# Altium schematic sheet converter.SchDoc
size A3; SheetNumber: 3; SheetTotal: 5
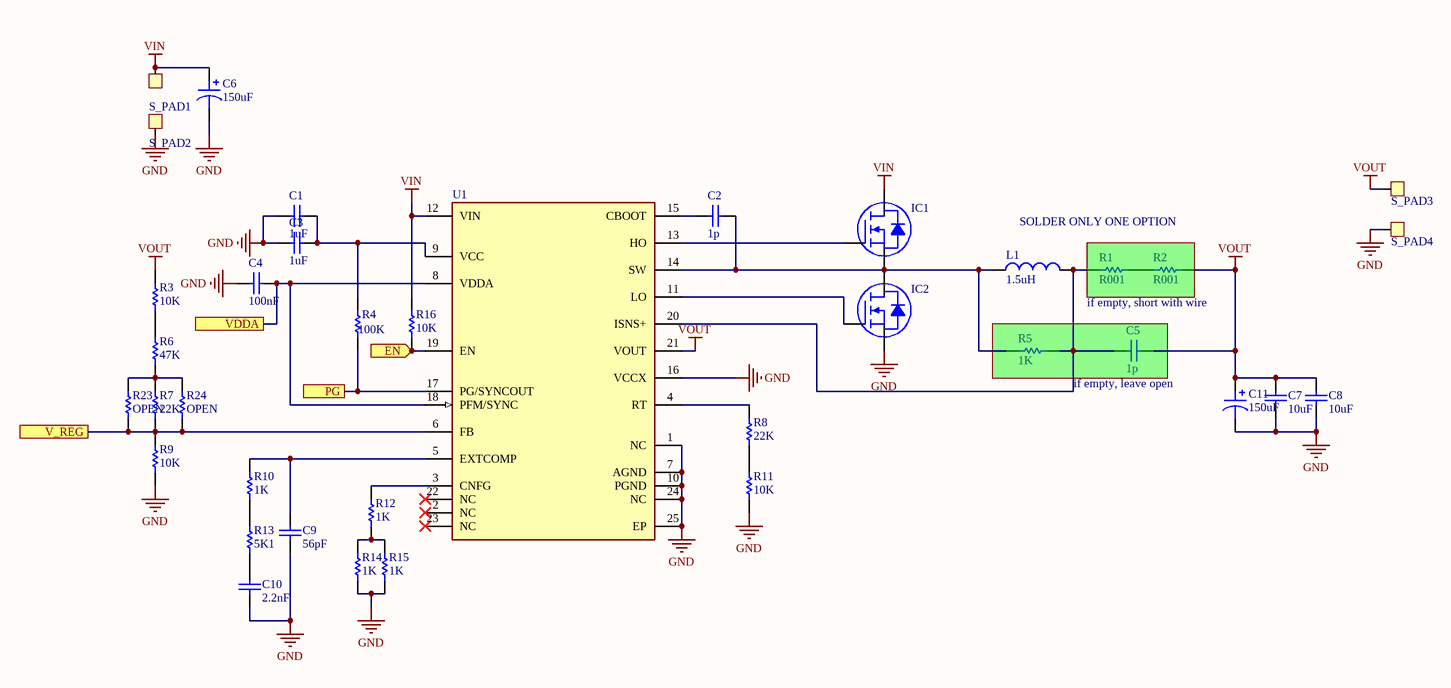
[diagram p0: converter.SchDoc]

## Parts
C1  value 1uF  [SMD-0603-RES]  (hidden comment: Capacitor)
C2  value 1p  [SMD-0603-RES]  (hidden comment: Capacitor)
C3  value 1uF  [SMD-0603-RES]  (hidden comment: Capacitor)
C4  value 100nF  [SMD-0603-RES]  (hidden comment: Capacitor)
C5  value 1p  [SMD-0603-RES]  (hidden comment: Capacitor)
C6  150uF  [CAPAE7266X80M]
C7  value 10uF  [SMD-0603-RES]  (hidden comment: Capacitor)
C8  value 10uF  [SMD-0603-RES]  (hidden comment: Capacitor)
C9  value 56pF  [SMD-0603-RES]  (hidden comment: Capacitor)
C10  value 2.2nF  [SMD-0603-RES]  (hidden comment: Capacitor)
C11  150uF  [CAPAE7266X80M]
IC1  MOSFET N-CH SOT-23-3  [DPAK228P1975X238-3N]  (value not drawn)
IC2  MOSFET N-CH SOT-23-3  [DPAK228P1975X238-3N]  (value not drawn)
L1  value 1.5uH  [INDP135127X65N]  (hidden comment: Inductor)
R1  value R001  [SMD-1206-RES]  (hidden comment: Resistor)
R2  value R001  [SMD-1206-RES]  (hidden comment: Resistor)
R3  value 10K  [SMD-0603-RES]  (hidden comment: Resistor)
R4  value 100K  [SMD-0603-RES]  (hidden comment: Resistor)
R5  value 1K  [SMD-0603-RES]  (hidden comment: Resistor)
R6  value 47K  [SMD-0603-RES]  (hidden comment: Resistor)
R7  value 22K  [SMD-0603-RES]  (hidden comment: Resistor)
R8  value 22K  [SMD-0603-RES]  (hidden comment: Resistor)
R9  value 10K  [SMD-0603-RES]  (hidden comment: Resistor)
R10  value 1K  [SMD-0603-RES]  (hidden comment: Resistor)
R11  value 10K  [SMD-0603-RES]  (hidden comment: Resistor)
R12  value 1K  [SMD-0603-RES]  (hidden comment: Resistor)
R13  value 5K1  [SMD-0603-RES]  (hidden comment: Resistor)
R14  value 1K  [SMD-0603-RES]  (hidden comment: Resistor)
R15  value 1K  [SMD-0603-RES]  (hidden comment: Resistor)
R16  value 10K  [SMD-0603-RES]  (hidden comment: Resistor)
R23  value OPEN  [SMD-0603-RES]  (hidden comment: Resistor)
R24  value OPEN  [SMD-0603-RES]  (hidden comment: Resistor)
S_PAD1  SOLDER_PAD  [POWER_PAD]  (value not drawn)
S_PAD2  SOLDER_PAD  [POWER_PAD]  (value not drawn)
S_PAD3  SOLDER_PAD  [POWER_PAD]  (value not drawn)
S_PAD4  SOLDER_PAD  [POWER_PAD]  (value not drawn)
U1  (no value)  [FP-RGY0024E-MFG]

## Blocks framed on the sheet
if empty, short with wire: C5 R5

## Ports
EN (in, see COMBINED[4B]), PG (see COMBINED[4B]), V_REG (see COMBINED[4B]), VDDA (see COMBINED[4B])

## Nets
GND: C1.1 C3.1 C4.2 C6.2 C7.1 C8.1 C9.1 C10.2 C11.2 IC2.3(S) R9.1 R11.2 R14.2 R15.2 S_PAD2.1 S_PAD4.1 U1.1(NC) U1.7(AGND) U1.10(PGND) U1.16(VCCX) U1.24(NC) U1.25(EP)
VIN: C6.1 IC1.2(D) R16.2 S_PAD1.1 U1.12(VIN)
VOUT: C5.2 C7.2 C8.2 C11.1 R2.2 R3.2 S_PAD3.1 U1.21(VOUT)
EN: R16.1 U1.19(EN) ; port EN
PG: R4.1 U1.17(PG/SYNCOUT) ; port PG
V_REG: R7.1 R9.2 R23.1 R24.1 U1.6(FB) ; port V_REG
VDDA: C4.1 U1.8(VDDA) U1.18(PFM/SYNC) ; port VDDA
NetC1_2: C1.2 C3.2 R4.2 U1.9(VCC)
NetC2_1: C2.1 IC1.3(S) IC2.2(D) L1.1 R5.1 U1.14(SW)
NetC2_2: C2.2 U1.15(CBOOT)
NetC5_1: C5.1 L1.2 R1.1 R5.2 U1.20(ISNS+)
NetC9_2: C9.2 R10.2 U1.5(EXTCOMP)
NetC10_1: C10.1 R13.1
NetIC1_1: IC1.1(G) U1.13(HO)
NetIC2_1: IC2.1(G) U1.11(LO)
NetR1_2: R1.2 R2.1
NetR3_1: R3.1 R6.2
NetR6_1: R6.1 R7.2 R23.2 R24.2
NetR8_1: R8.1 R11.1
NetR8_2: R8.2 U1.4(RT)
NetR10_1: R10.1 R13.2
NetR12_1: R12.1 U1.3(CNFG)
NetR12_2: R12.2 R14.1 R15.1

Not connected (* = marked no-connect by the designer): U1 2(NC)* 22(NC)* 23(NC)*

## Notes on the sheet
- SOLDER ONLY ONE OPTION
- if empty, leave open

## Library data of the parts
C1-C5 C7-C10 = Capacitor: SimulationGenericComponent: True
C6 C11 = Polarised Capacitor: SMT Polarised Capacitor; Value: 150uF
IC1 IC2 = DIODES INC MOSFET N-CH SOT-23-3
L1 = Inductor: DMBJ CXP1040-1R5M-AG(1.5uh); SimulationGenericComponent: True
R1 R2 = Resistor: 1mOhm current sense; TC1: 0; SimulationGenericComponent: True; TC2: 0
R3-R16 R23 R24 = Resistor: TC1: 0; SimulationGenericComponent: True; TC2: 0
U1 = CMP-00370-134525155-1: LM5148QRGYRQ1 Automotive, 80-V synchronous buck DC/DC controller with ultra-low IQ 24-VQFN -40 to 125; Manufacturer Lifecycle Status: ACTIVE; Case/Package: VQFN; Number of Pins: 24; Length: 5.5mm; Width: 3.5mm; Thickness: 900µm; NexarPartId: 134525155; Lifecycle Status: Production; Height: 1mm